# EAGLE schematic robot-actuator-esp32-v2 (EAGLE 9.4.2)
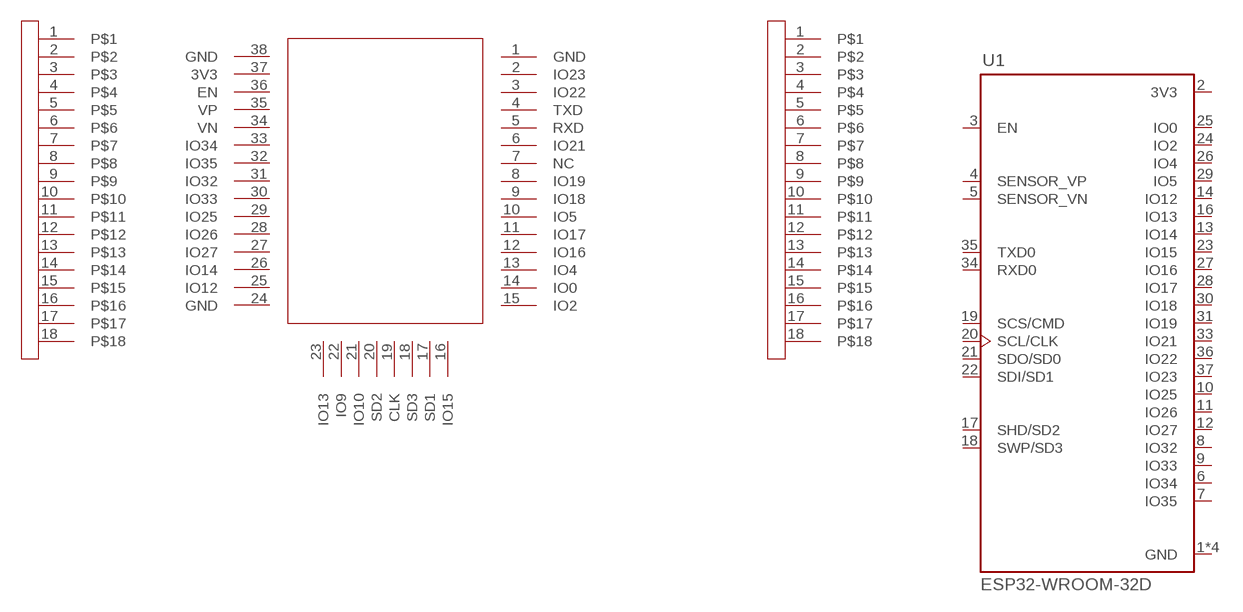
[diagram p0: schematic, sheet 1]

## Parts
U1  ESP32-WROOM-32D  [MODULE_ESP32-WROOM-32D]
U$1  TTGO-MICRO32  [TTG0-MICRO32-V2]
U$2  1.27MMHDR18PIN  [HDRV18W40P127_1X18_2257X208X508C]
U$3  1.27MMHDR18PIN  [HDRV18W40P127_1X18_2257X208X508C]
Unconnected: U1.3(EN) U1.4(SENSOR_VP) U1.5(SENSOR_VN) U1.6(IO34) U1.7(IO35) U1.8(IO32) U1.9(IO33) U1.10(IO25) U1.11(IO26) U1.12(IO27) U1.13(IO14) U1.14(IO12) U1.16(IO13) U1.17(SHD/SD2) U1.18(SWP/SD3) U1.19(SCS/CMD) U1.20(SCL/CLK) U1.21(SDO/SD0) U1.22(SDI/SD1) U1.23(IO15) U1.24(IO2) U1.25(IO0) U1.26(IO4) U1.27(IO16) U1.28(IO17) U1.29(IO5) U1.30(IO18) U1.31(IO19) U1.33(IO21) U1.34(RXD0) U1.35(TXD0) U1.36(IO22) U1.37(IO23) U$1.1(GND) U$1.2(IO23) U$1.3(IO22) U$1.4(TXD) U$1.5(RXD) U$1.6(IO21) U$1.7(NC) U$1.8(IO19) U$1.9(IO18) U$1.10(IO5) U$1.11(IO17) U$1.12(IO16) U$1.13(IO4) U$1.14(IO0) U$1.15(IO2) U$1.16(IO15) U$1.17(SD1) U$1.18(SD3) U$1.19(CLK) U$1.20(SD2) U$1.21(IO10) U$1.22(IO9) U$1.23(IO13) U$1.24(GND) U$1.25(IO12) U$1.26(IO14) U$1.27(IO27) U$1.28(IO26) U$1.29(IO25) U$1.30(IO33) U$1.31(IO32) U$1.32(IO35) U$1.33(IO34) U$1.34(VN) U$1.35(VP) U$1.36(EN) U$1.37(3V3) U$1.38(GND) U$2.1 U$2.2 U$2.3 U$2.4 U$2.5 U$2.6 U$2.7 U$2.8 U$2.9 U$2.10 U$2.11 U$2.12 U$2.13 U$2.14 U$2.15 U$2.16 U$2.17 U$2.18 U$3.1 U$3.2 U$3.3 U$3.4 U$3.5 U$3.6 U$3.7 U$3.8 U$3.9 U$3.10 U$3.11 U$3.12 U$3.13 U$3.14 U$3.15 U$3.16 U$3.17 U$3.18

## Power pins joined to a net without a drawn wire
3V3: U1.2(3V3)
GND: U1.1(GND) U1.15(GND) U1.38(GND) U1.39(GND)

## Library data of the parts
U1 = ESP32-WROOM-32D:ESP32-WROOM-32D: IC: SoC; GPIO, I2C, I2S, IR, SD, SDIO, SPI, UART; 2.7÷3.6VDC; 20dBm; DESCRIPTION: IC: SoC; GPIO, I2C, I2S, IR, SD, SDIO, SPI, UART; 2.7÷3.6VDC; 20dBm; DIGI-KEY_PART_NUMBER: 1904-1023-1-ND; DIGI-KEY_PURCHASE_URL: https://www.digikey.es/product-detail/en/espressif-systems/ESP32-WROOM-32D/1904-1023-1-ND/9381732?utm_source=snapeda&utm_medium=aggregator&utm_campaign=symbol; MF: Espressif Systems; MP: ESP32-WROOM-32D; PACKAGE: Module Espressif Systems
U$1 = ttgo-micro32-v2:TTGO-MICRO32
U$2 U$3 = hdr1pt27mm:1.27MMHDR18PIN